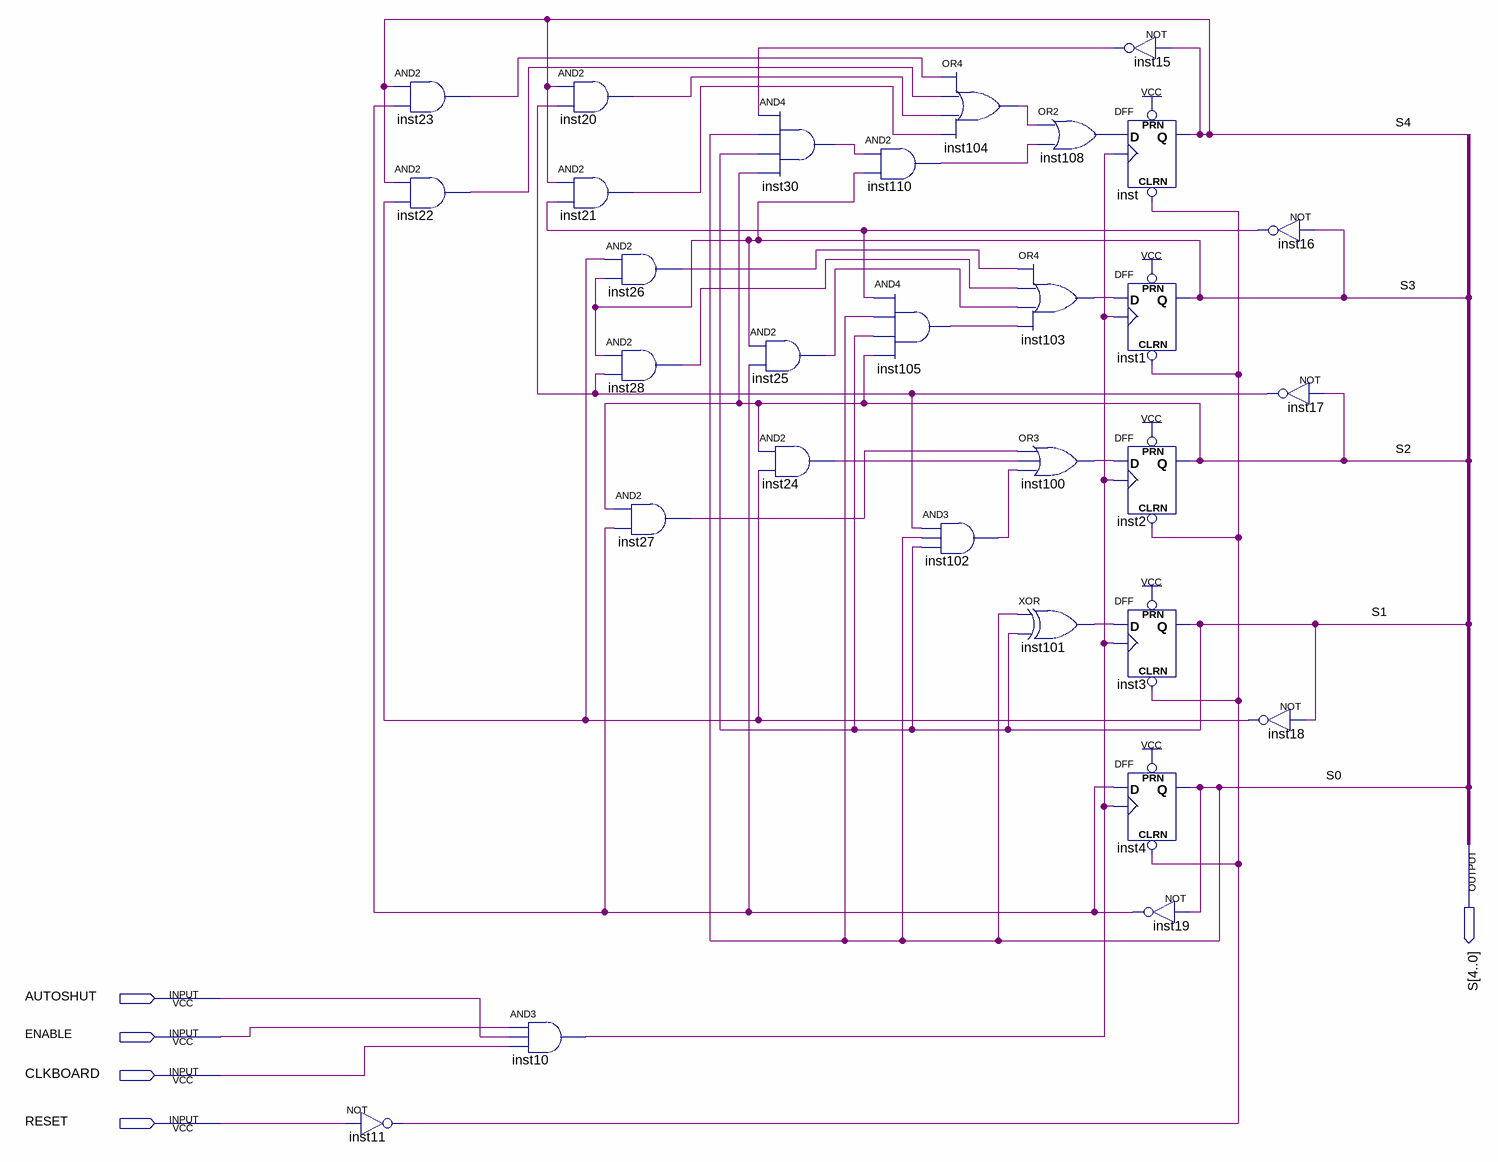
[diagram p0: schematic sheet]
// Quartus schematic mod32counter.bdf as structural Verilog: 30 symbols, 5 pins
module mod32counter (
  input  AUTOSHUT,
  input  ENABLE,
  input  CLKBOARD,
  input  RESET,
  output [4:0] S
);

  wire inst10_out, inst11_out, inst15_out, inst16_out, inst17_out, inst18_out, inst19_out, inst20_out,
       inst21_out, inst22_out, inst23_out, inst24_out, inst25_out, inst26_out, inst27_out, inst28_out,
       inst30_out, inst100_out, inst101_out, inst102_out, inst103_out, inst104_out, inst105_out, inst108_out,
       inst110_out;

  not inst11 (inst11_out, RESET);
  and inst23 (inst23_out, S[4], inst19_out);
  and inst22 (inst22_out, S[4], inst18_out);
  and inst10 (inst10_out, ENABLE, AUTOSHUT, CLKBOARD);
  and inst20 (inst20_out, S[4], inst17_out);
  and inst21 (inst21_out, S[4], inst16_out);
  and inst26 (inst26_out, inst18_out, S[3]);
  and inst28 (inst28_out, S[3], inst17_out);
  and inst27 (inst27_out, S[2], inst19_out);
  and inst30 (inst30_out, inst15_out, S[0], S[1], S[2]);
  and inst25 (inst25_out, S[3], inst19_out);
  and inst24 (inst24_out, S[2], inst18_out);
  and inst110 (inst110_out, inst30_out, S[3]);
  and inst105 (inst105_out, inst16_out, S[0], S[1], S[2]);
  or inst104 (inst104_out, inst23_out, inst22_out, inst20_out, inst21_out);
  and inst102 (inst102_out, inst17_out, S[0], S[1]);
  or inst108 (inst108_out, inst104_out, inst110_out);
  or inst103 (inst103_out, inst26_out, inst28_out, inst25_out, inst105_out);
  or inst100 (inst100_out, inst27_out, inst24_out, inst102_out);
  xor inst101 (inst101_out, S[0], S[1]);
  not inst15 (inst15_out, S[4]);
  DFF inst (.CLRN(inst11_out), .CLK(inst10_out), .D(inst108_out), .PRN(1'b1), .Q(S[4]));
  DFF inst1 (.CLRN(inst11_out), .CLK(inst10_out), .D(inst103_out), .PRN(1'b1), .Q(S[3]));
  DFF inst2 (.CLRN(inst11_out), .CLK(inst10_out), .D(inst100_out), .PRN(1'b1), .Q(S[2]));
  DFF inst3 (.CLRN(inst11_out), .CLK(inst10_out), .D(inst101_out), .PRN(1'b1), .Q(S[1]));
  DFF inst4 (.CLRN(inst11_out), .CLK(inst10_out), .D(inst19_out), .PRN(1'b1), .Q(S[0]));
  not inst19 (inst19_out, S[0]);
  not inst16 (inst16_out, S[3]);
  not inst17 (inst17_out, S[2]);
  not inst18 (inst18_out, S[1]);
endmodule
